# EAGLE design Lipo_Charger_Basic (EAGLE 7.2.0)
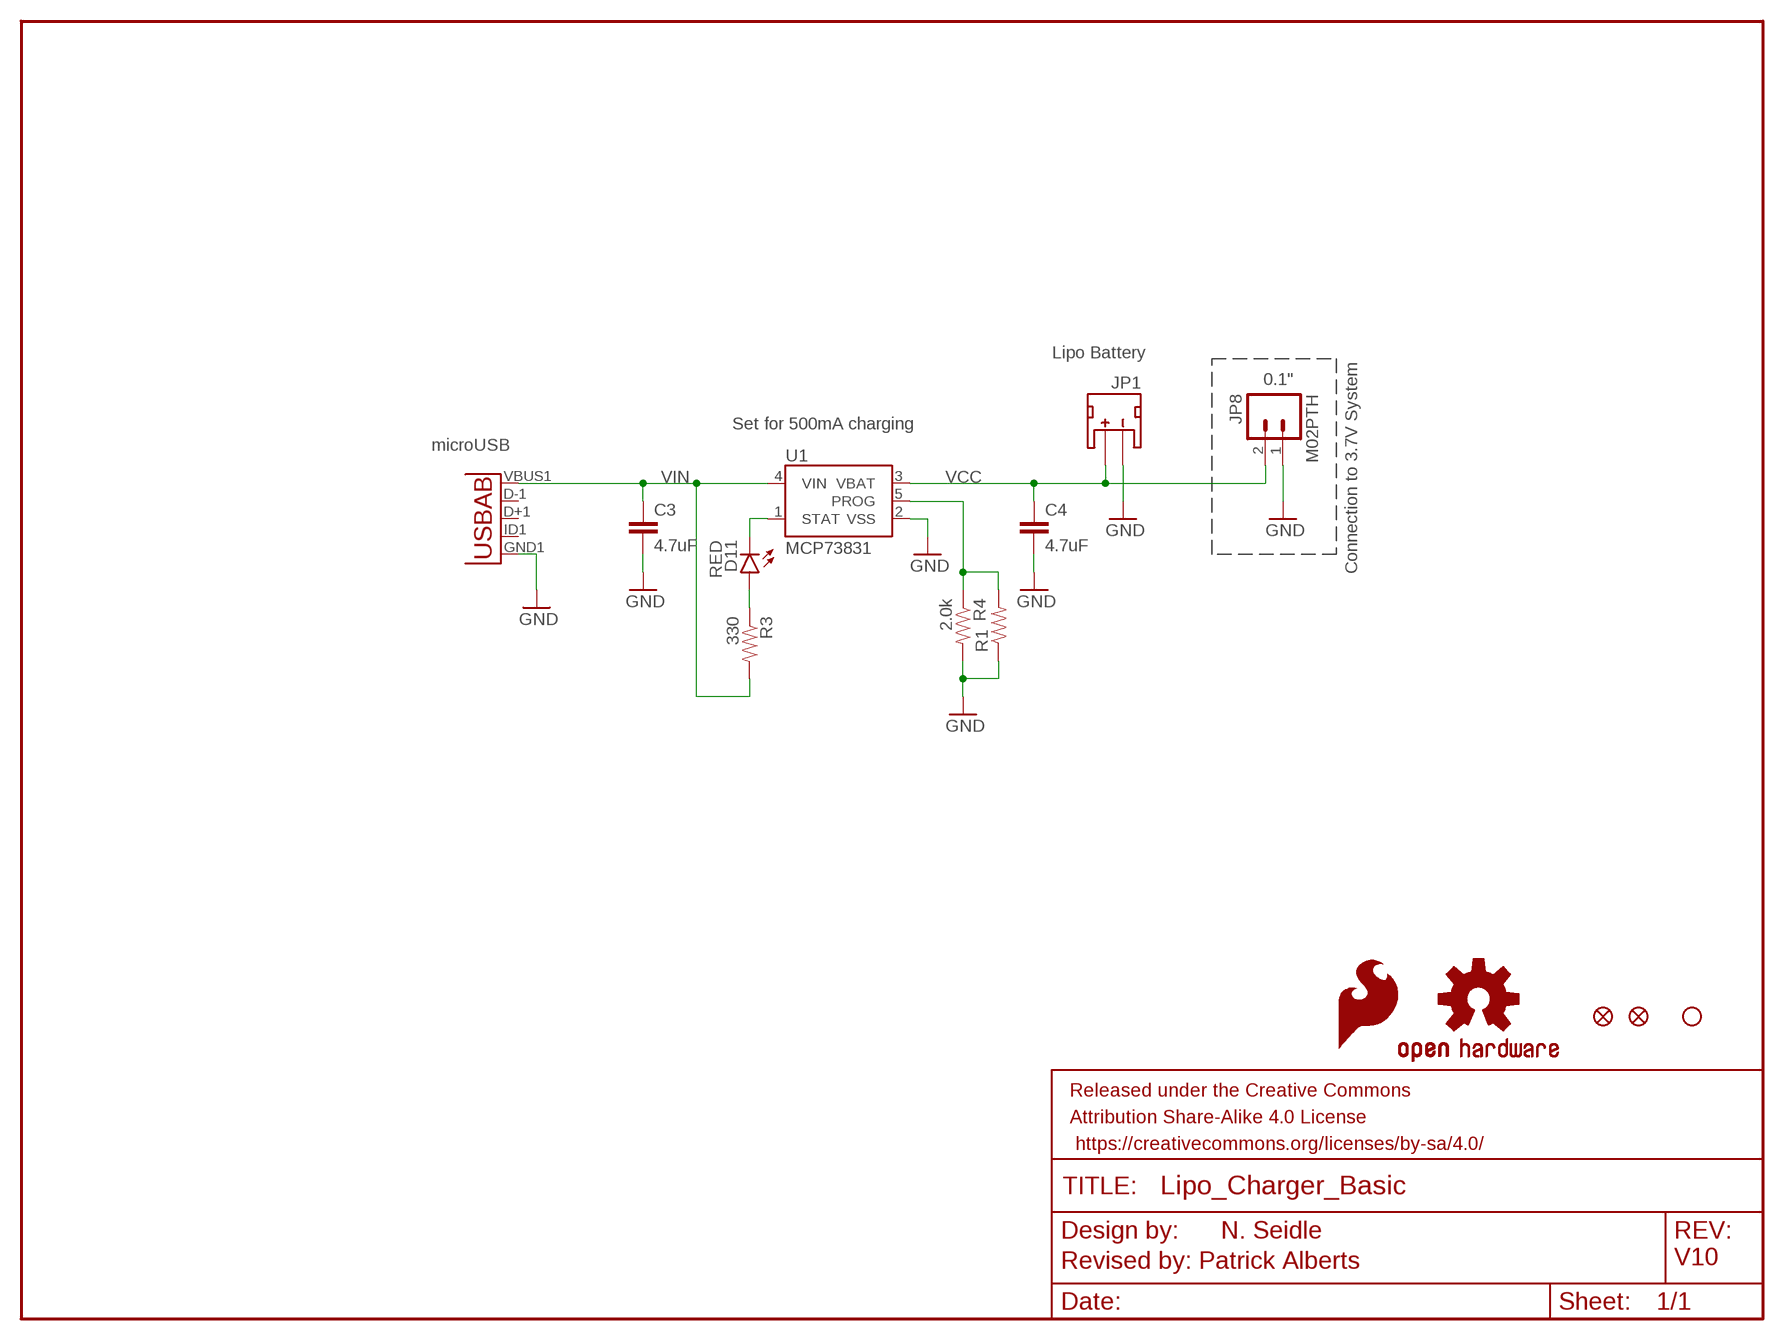
[diagram p0: schematic, sheet 1]

## Parts
C3  4.7uF  4.7UF-6.3V-10%(0603)0603  [0603-CAP]
C4  4.7uF  4.7UF-6.3V-10%(0603)0603  [0603-CAP]
D11  RED  LED-RED0603  [LED-0603]
FRAME1  FRAME-LETTER  [CREATIVE_COMMONS]
JP1  JST  JST_2MM_MALE  [JST-2-SMD]
JP2  STAND-OFF  [STAND-OFF]
JP3  FIDUCIAL1X2  [FIDUCIAL-1X2]
JP4  FIDUCIAL1X2  [FIDUCIAL-1X2]
JP8  M02PTH  [1X02]
JP9  Micro USB  USB-ABCONN-11794  [USB-AB-MICRO-SMD_V03]
LOGO1  OSHW-LOGOS  [OSHW-LOGO-S]
LOGO2  SFE_LOGO_FLAME.1_INCH  [SFE_LOGO_FLAME_.1]
R1  RESISTORPTH-1/4W-VERT-KIT  [AXIAL-0.1EZ]
R3  330  330OHM1/10W1%(0603)  [0603-RES]
R4  2.0k  2.0KOHM1/10W5%(0603)  [0603-RES]
U1  MCP73831  [SOT23-5]

## Nets
GND: C3.2 C4.2 JP1.1(-) JP8.1 JP9.GND1(GND) R1.P$1 R4.2 U1.2(VSS)
N$3: D11.A R3.1
PROG: R1.P$2 R4.1 U1.5(PROG)
STAT: D11.C U1.1(STAT)
VCC: C4.1 JP1.2(+) JP8.2 U1.3(VBAT)
VIN: C3.1 JP9.VBUS1(VBUS) R3.2 U1.4(VIN)
Unconnected: JP1.NC1(PAD1) JP1.NC2(PAD2) JP9.D+1(D+) JP9.D-1(D-) JP9.ID1(USBID)

## Notes on the sheet
- Lipo Battery
- 0.1"
- Set for 500mA charging
- microUSB
- Connection to 3.7V System
- N. Seidle
- Revised by: Patrick Alberts | V10

## Library data of the parts
C3 C4 = SparkFun-Capacitors:4.7UF-6.3V-10%(0603): CAP-08280; PROD_ID: CAP-08280
D11 = SparkFun-LED:LED-RED: Assorted Red LEDs LilyPad 1206- DIO-09912 1206- DIO-00809 0603- DIO-00819; PROD_ID: DIO-00819
FRAME1 = SparkFun-Aesthetics:FRAME-LETTER: Schematic Frame Standard 8.5x11 US Letter frame
JP1 = SparkFun-Connectors:JST_2MM_MALE: Mates to single-cell LiPo batteries. CONN-08352; PROD_ID: CONN-08352
JP2 = SparkFun:STAND-OFF: Stand Off This is the mechanical footprint for a #4 phillips button head screw. Use the keepout ring to avoid running the screw head into surrounding components. SKU : PRT-00447
JP3 JP4 = SparkFun:FIDUCIAL: Fiducial Alignment Points Various fiducial points for machine vision alignment.
JP8 = SparkFun-Connectors:M02: Standard 2-pin 0.1" header. Use with - straight break away headers ( PRT-00116) - right angle break away headers (PRT-00553) - swiss pins (PRT-00743) - machine pins (PRT-00117) - female headers (PRT-00115) Molex polarized connector foot print use with: PRT-08233 with associated crimp pins and housings. 2.54_SCREWTERM for use with PRT-10571. 3.5mm Screw Terminal footprints for PRT-08084 5mm Screw Terminal footprints for use with PRT-08432
JP9 = SparkFun-Connectors:USB-AB: This is a USB AB connector that is compatible with USB OTG. i.e. this connector can serve as a host or device; PROD_ID: CONN-11794
LOGO1 = SparkFun-Aesthetics:OSHW-LOGO: Open Source Hardware Logo This logo indicates the piece of hardware it is found on incorporates a OSHW license and/or adheres to the definition of open source hardware found here: http://freedomdefined.org/OSHW
LOGO2 = SparkFun-Aesthetics:SFE_LOGO_FLAME: SFE Logo, flame only This is the SparkFun flame logo. The logo on the schematic will always be the same size; the package variant is the height of the flame. Default layer for the logo on the board is tSilk.
R1 = SparkFun-Resistors:RESISTOR: Resistor Basic schematic elements and footprints for 0603, 1206, and PTH resistors.
R3 = SparkFun-Resistors:330OHM1/10W1%(0603): RES-00818; PROD_ID: RES-00818
R4 = SparkFun-Resistors:2.0KOHM1/10W5%(0603): RES-08296; PROD_ID: RES-08296
U1 = SparkFun-PowerIC:MCP73831: Miniature single cell, fully integrated Li-Ion, Li-polymer charge management controller http://ww1.microchip.com/downloads/en/DeviceDoc/21984a.pdf IC-09995; PROD_ID: IC-09995

## Board
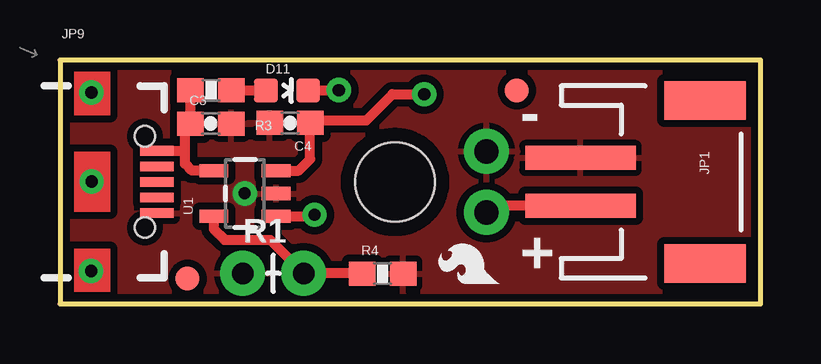
[diagram p1: board, top side]
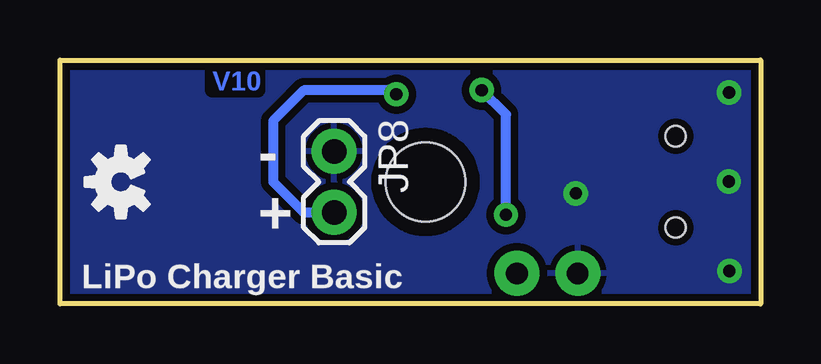
[diagram p2: board, bottom side, seen from below]

Size 29.21 x 10.16 mm. Coordinates in mm from the lower left corner, seen from the top.
Outline: 29.21,0 29.21,10.16 0,10.16 0,0 29.21,0
Copper layers (1*16): Top 0.035mm / dielectric 1.5mm / Bottom 0.035mm
Design rules "SparkFun-2-layer": minimum track width 7mil, minimum drill 15mil, track to track 8mil, track to pad 8mil, pad to pad 8mil, via to via 8mil, smd to smd 8mil, copper to edge 8mil, drill to drill 8mil, minimum pad ring 12mil, minimum via ring 10mil, stop-mask expansion 4mil, vias tented up to drill 20mil, thermal gap 10mil

### Footprints (pad centres in the part's own frame; a part is rotated, then mirrored left to right if it is on the bottom)
0603-CAP = smd 1.1 x 1: 1 -0.85,0; 2 0.85,0
LED-0603 = smd 1 x 1: A 0,-0.877; C 0,0.877
JST-2-SMD = smd 1 x 4.6: 1 -1,-3.7; 2 1,-3.7 | smd 1.6 x 3.4: NC1 -3.4,1.5; NC2 3.4,1.5
STAND-OFF = hole 3.302: 0,0
FIDUCIAL-1X2 = smd 1 x 1: 1 0,0
1X02 = drill 1.016 pad 1.88: 1 0,0; 2 2.54,0
USB-AB-MICRO-SMD_V03 = smd 1.4 x 0.4: D+1 2.7,0; D-1 2.7,0.65; GND1 2.7,-1.3; ID1 2.7,-0.65; VBUS1 2.7,1.3 | hole 0.85: 2.2,1.9; 2.2,-1.9
AXIAL-0.1EZ = drill 0.9 pad 1.88: P$1 0,0; P$2 2.54,0
0603-RES = smd 1.1 x 1: 1 -0.85,0; 2 0.85,0
SOT23-5 = smd 0.55 x 1.2: 1 -0.95,-1.3; 2 0,-1.3; 3 0.95,-1.3; 4 0.95,1.3; 5 -0.95,1.3

### Placement (x,y rotation side)
C3  6.29,7.51 0 top
C4  9.59,7.54 180 top
D11  9.47,8.89 270 top
FRAME1  -13.44,-11.43 0 top  (outside the outline)
JP1  25.4,5.08 270 top
JP2  13.97,5.08 0 top
JP3  5.32,1.05 0 top
JP4  19.05,8.89 0 top
JP8  17.78,6.35 270 bottom
JP9  1.34,5.08 0 top
LOGO1  26.67,5.08 90 bottom
LOGO2  18.67,0.51 90 top
R1  7.62,1.27 0 top
R3  6.29,8.9 180 top
R4  13.45,1.26 0 top
U1  7.71,4.6 90 top

### Tracks (layer width: path | path; a pad name or v marks a point on that pad's centre or on a via)
GND  (via drill 0.51)
  other vias: 7.7,4.6 1.31,8.8 1.32,5.1 1.3,1.37
  pour Bottom (isolate 0.305): 0,0 0,10.16 29.21,10.16 29.21,0
  pour Top (isolate 0.305): 0,10.16 29.21,10.16 29.21,0 0,0
N$3
  Top 0.406: R3.1 8.58,8.9 D11.A
PROG
  Top 0.406: U1.5 6.41,3.11 6.86,2.67 8.76,2.67 R1.P$2 R4.1
STAT  (via drill 0.51)
  Top 0.305: 11.62,8.89 v11.63,8.9
  Top 0.406: D11.C 11.62,8.89 | U1.1 10.55,3.65 v10.62,3.71
  Bottom 0.406: v10.62,3.71 10.62,7.89 v11.63,8.9
VCC  (via drill 0.51)
  Top 0.406: v15.19,8.73 13.86,8.73 12.78,7.65 10.55,7.65 C4.1 10.43,7.52 10.43,6.03 9.95,5.55 U1.3 | JP1.2 18.05,4.08 JP8.2
  Bottom 0.406: JP8.2 19.05,3.81 20.32,5.08 20.32,7.62 19.05,8.89 15.34,8.89 v15.19,8.73
VIN
  Top 0.406: R3.2 C3.1 5.21,7.28 5.21,6.35 | 5.21,6.35 5.21,5.83 5.49,5.55 U1.4 | JP9.VBUS1 5.18,6.38 5.21,6.35

### Text on the board
Bottom: V10
tPlace: - | +
bPlace: - | + | LiPo Charger Basic
tDocu: N. Seidle | Revised by:Patrick Alberts